# EAGLE design amebot_leds (EAGLE 6.5.0)
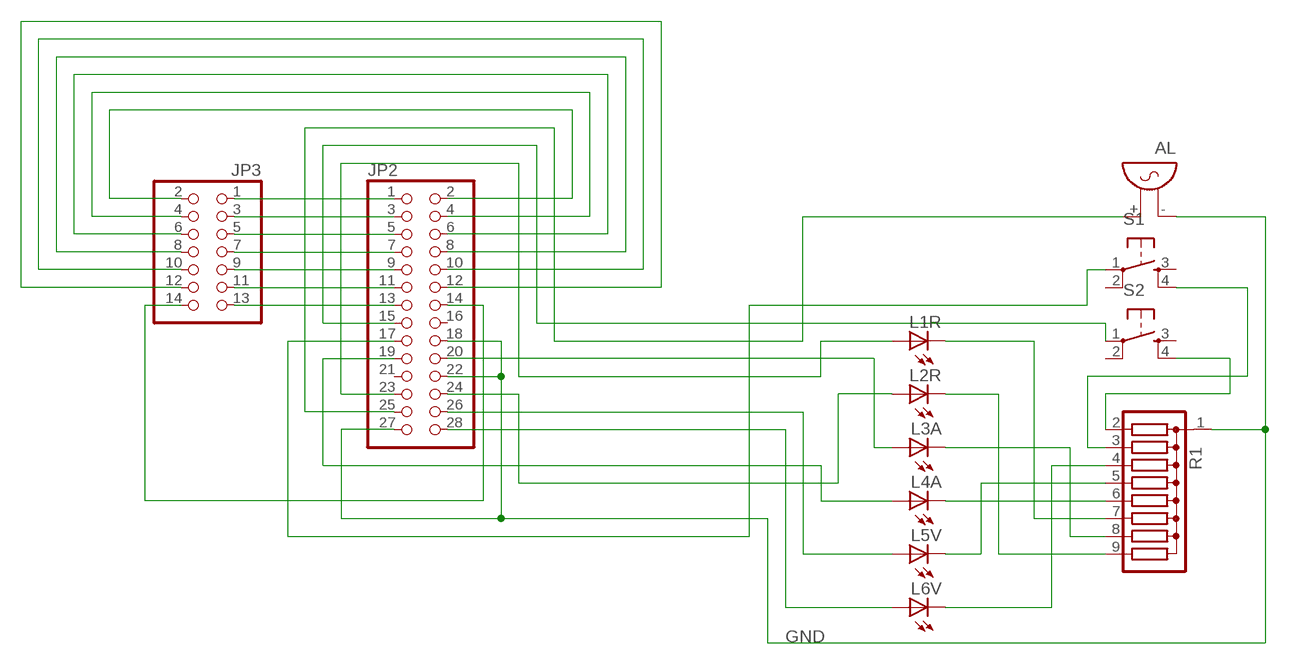
[diagram p0: schematic, sheet 1]

## Parts
AL  F/QMX  [F/QMX]
JP2  PINHD-2X14  [2X14]
JP3  PINHD-2X7  [2X07]
L1R  LED5MM  [LED5MM]
L2R  LED5MM  [LED5MM]
L3A  LED5MM  [LED5MM]
L4A  LED5MM  [LED5MM]
L5V  LED5MM  [LED5MM]
L6V  LED5MM  [LED5MM]
R1  G08R  [SIL9]
S1  DTS-6  [DTS-6]
S2  DTS-6  [DTS-6]

## Nets
GND: AL.- JP2.18 JP2.22 JP2.27
N$1: L5V.K(C) R1.5
N$2: JP2.23 L1R.A
N$3: AL.+ JP2.25
N$4: L3A.K(C) R1.8
N$5: JP2.15 S2.1
N$6: JP2.19 L4A.A
N$7: L4A.K(C) R1.6
N$8: L2R.K(C) R1.9
N$9: JP2.20 L3A.A
N$10: L1R.K(C) R1.7
N$12: L6V.K(C) R1.4
N$13: JP2.17 S1.1
N$15: R1.2 S2.4
N$16: R1.3 S1.4
N$21: JP2.24 L2R.A
N$23: JP2.28 L6V.A
N$24: JP2.26 L5V.A
N$28: JP2.1 JP3.1
N$29: JP2.3 JP3.3
N$30: JP2.5 JP3.5
N$31: JP2.7 JP3.7
N$32: JP2.9 JP3.9
N$33: JP2.11 JP3.11
N$34: JP2.13 JP3.13
N$35: JP2.2 JP3.2
N$36: JP2.4 JP3.4
N$37: JP2.6 JP3.6
N$38: JP2.8 JP3.8
N$39: JP2.10 JP3.10
N$40: JP2.12 JP3.12
N$41: JP2.14 JP3.14
Unconnected: JP2.16 JP2.21 R1.1 S1.2 S1.3 S2.2 S2.3

## Library data of the parts
AL = buzzer:F/QMX: BUZZER Source: Buerklin; OC_FARNELL: unknown; OC_NEWARK: unknown
JP2 = pinhead:PINHD-2X14: PIN HEADER
JP3 = pinhead:PINHD-2X7: PIN HEADER
L1R L2R L3A L4A L5V L6V = led:LED: LED OSRAM: - CHIPLED LG R971, LG N971, LY N971, LG Q971, LY Q971, LO R971, LY R971 LH N974, LH R974 LS Q976, LO Q976, LY Q976 LO Q996 - Hyper CHIPLED LW Q18S LB Q993, LB Q99A, LB R99A - SideLED LS A670, LO A670, LY A670, LG A670, LP A670 LB A673, LV A673, LT A673, LW A673 LH A674 LY A675 LS A676, LA A676, LO A676, LY A676, LW A676 LS A679, LY A679, LG A679 - Hyper Micro SIDELED® LS Y876, LA Y876, LO Y876, LY Y876 LT Y87S - SmartLED LW L88C, LW L88S LB L89C, LB L89S, LG L890 LS L89K, LO L89K, LY L89K LS L896, LA L896, LO L896, LY L896 - TOPLED LS T670, LO T670, LY T670, LG T670, LP T670 LSG T670, LSP T670, LSY T670, LOP T670, LYG T670 LG T671, LOG T671, LSG T671 LB T673, LV T673, LT T673, LW T673 LH T674 LS T676, LA T676, LO T676, LY T676, LB T676, LH T676, LSB T676, LW T676 LB T67C, LV T67C, LT T67C, LS T67K, LO T67K, LY T67K, LW E67C LS E67B, LA E67B, LO E67B, LY E67B, LB E67C, LV E67C, LT E67C LW T67C LS T679, LY T679, LG T679 LS T770, LO T770, LY T770, LG T770, LP T770 LB T773, LV T773, LT T773, LW T773 LH T774 LS E675, LA E675, LY E675, LS T675 LS T776, LA T776, LO T776, LY T776, LB T776 LHGB T686 LT T68C, LB T68C - Hyper Mini TOPLED® LB M676 - Mini TOPLED Santana® LG M470 LS M47K, LO M47K, LY M47K Source: http://www.osram.convergy.de LUXEON: - LUMILED® LXK2-PW12-R00, LXK2-PW12-S00, LXK2-PW14-U00, LXK2-PW14-V00 LXK2-PM12-R00, LXK2-PM12-S00, LXK2-PM14-U00 LXK2-PE12-Q00, LXK2-PE12-R00, LXK2-PE12-S00, LXK2-PE14-T00, LXK2-PE14-U00 LXK2-PB12-K00, LXK2-PB12-L00, LXK2-PB12-M00, LXK2-PB14-N00, LXK2-PB14-P00, LXK2-PB14-Q00 LXK2-PR12-L00, LXK2-PR12-M00, LXK2-PR14-Q00, LXK2-PR14-R00 LXK2-PD12-Q00, LXK2-PD12-R00, LXK2-PD12-S00 LXK2-PH12-R00, LXK2-PH12-S00 LXK2-PL12-P00, LXK2-PL12-Q00, LXK2-PL12-R00 Source: www.luxeon.com KINGBRIGHT: KA-3528ASYC Source: www.kingbright.com
R1 = resistor-sil:G08R: SIL RESISTOR; OC_FARNELL: unknown; OC_NEWARK: unknown
S1 S2 = switch-tact:DTS-6

## Board
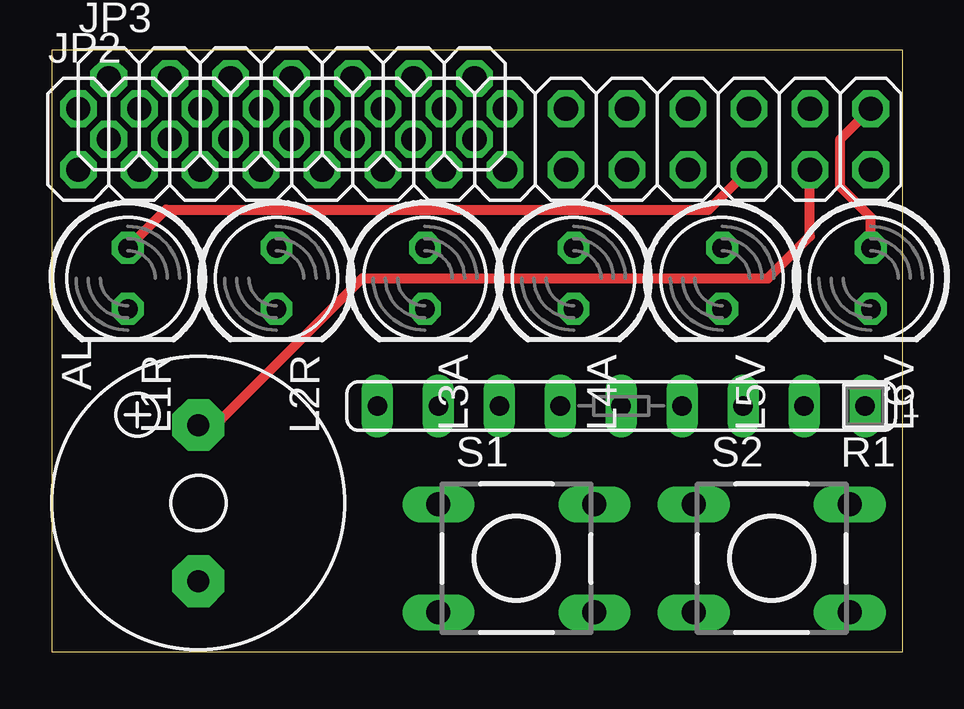
[diagram p1: board, top side]
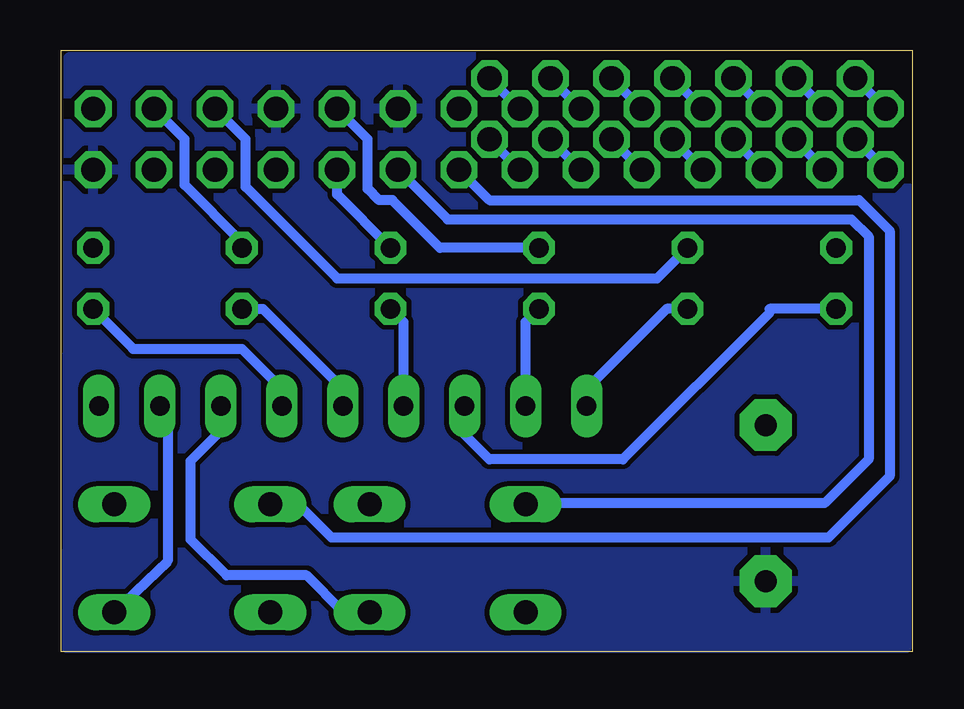
[diagram p2: board, bottom side, seen from below]

No outline drawn. Coordinates in mm, seen from the top.
Copper layers (1*16): Top 0.035mm / dielectric 1.5mm / Bottom 0.035mm
Design rules "default": minimum track width 10mil, minimum drill 24mil, track to track 8mil, track to pad 8mil, pad to pad 8mil, via to via 8mil, smd to smd 8mil, copper to edge 40mil, drill to drill 8mil, minimum pad ring 10mil, minimum via ring 8mil, stop-mask expansion 4mil, vias tented up to drill 0mil, thermal gap 10mil
Milling: 4 lines

### Footprints (pad centres in the part's own frame; a part is rotated, then mirrored left to right if it is on the bottom)
F/QMX = drill 0.914 pad 2.159 octagon: + 3.251,0; - -3.251,0
2X14 = drill 1.016 octagon: 1 -16.51,-1.27; 2 -16.51,1.27; 3 -13.97,-1.27; 4 -13.97,1.27; 5 -11.43,-1.27; 6 -11.43,1.27; 7 -8.89,-1.27; 8 -8.89,1.27; 9 -6.35,-1.27; 10 -6.35,1.27; 11 -3.81,-1.27; 12 -3.81,1.27; 13 -1.27,-1.27; 14 -1.27,1.27; 15 1.27,-1.27; 16 1.27,1.27; 17 3.81,-1.27; 18 3.81,1.27; 19 6.35,-1.27; 20 6.35,1.27; 21 8.89,-1.27; 22 8.89,1.27; 23 11.43,-1.27; 24 11.43,1.27; 25 13.97,-1.27; 26 13.97,1.27; 27 16.51,-1.27; 28 16.51,1.27
2X07 = drill 1.016 octagon: 1 -7.62,-1.27; 2 -7.62,1.27; 3 -5.08,-1.27; 4 -5.08,1.27; 5 -2.54,-1.27; 6 -2.54,1.27; 7 0,-1.27; 8 0,1.27; 9 2.54,-1.27; 10 2.54,1.27; 11 5.08,-1.27; 12 5.08,1.27; 13 7.62,-1.27; 14 7.62,1.27
LED5MM = drill 0.813 octagon: A -1.27,0; K 1.27,0
SIL9 = drill 0.813 long: 1 -10.16,0; 2 -7.62,0; 3 -5.08,0; 4 -2.54,0; 5 0,0; 6 2.54,0; 7 5.08,0; 8 7.62,0; 9 10.16,0
DTS-6 = drill 1 long: 1 -3.25,2.25; 2 3.25,2.25; 3 -3.25,-2.25; 4 3.25,-2.25

### Placement (x,y rotation side)
AL  6.11,6.19 90 top
JP2  17.62,21.35 0 top
JP3  10,22.62 0 top
L1R  3.17,15.56 270 top
L2R  9.37,15.56 270 top
L3A  15.56,15.56 270 top
L4A  21.75,15.56 270 top
L5V  27.94,15.56 270 top
L6V  34.13,15.56 270 top
R1  23.73,10.24 180 top
S1  19.37,3.89 0 top
S2  30,3.89 0 top

### Tracks (layer width: path | path; a pad name or v marks a point on that pad's centre or on a via)
GND
  pour Bottom: 0.24,24.77 35.16,24.77 35.24,0.16 0.24,0.16
N$1
  Bottom 0.406: L5V.K 27.07,14.29 23.81,11.03 23.81,10.32 R1.5
N$2
  Top 0.406: L1R.A 4.76,18.41 27.38,18.41 JP2.23
N$3
  Top 0.406: AL.+ 6.82,9.44 12.94,15.56 29.84,15.56 31.59,17.3 JP2.25
N$4
  Bottom 0.406: R1.8 16.11,13.73 L3A.K
N$5
  Bottom 0.406: JP2.15 17.62,18.81 2.22,18.81 0.95,17.54 0.95,7.3 3.29,4.96 3.49,4.76 24.21,4.76 25.59,6.14 S2.1
N$6
  Bottom 0.406: L4A.A 23.97,19.05 JP2.19
N$7
  Bottom 0.406: R1.6 21.19,13.73 L4A.K
N$8
  Bottom 0.406: L2R.K 10.24,14.29 13.57,10.95 R1.9
N$9
  Bottom 0.406: L3A.A 19.68,16.83 21.67,18.81 22.23,18.81 22.7,19.29 22.7,21.35 JP2.20
N$10
  Bottom 0.406: L1R.K 5.95,14.29 5.95,14.13 12.06,8.02 17.62,8.02 18.65,9.05 R1.7
N$12
  Bottom 0.406: L6V.K 32.46,12.62 27.94,12.62 26.27,10.95 R1.4
N$13
  Bottom 0.406: JP2.17 19.37,18.02 2.54,18.02 1.83,17.3 1.83,8.02 3.65,6.19 16.07,6.19 S1.1
N$15
  Bottom 0.406: S2.4 31.04,3.78 31.04,9.92 R1.2
N$16
  Bottom 0.406: R1.3 28.81,9.21 30.08,7.94 30.08,4.68 28.57,3.17 25.24,3.17 23.71,1.64 S1.4
N$21
  Bottom 0.406: JP2.24 27.78,21.35 27.78,19.37 23.97,15.56 10.64,15.56 L2R.A
N$23
  Top 0.406: JP2.28 32.86,21.35 32.86,19.37 34.13,18.1 L6V.A
N$24
  Bottom 0.406: JP2.26 30.32,21.35 30.32,19.45 27.94,17.07 L5V.A
N$28
  Bottom 0.406: JP3.1 JP2.1
N$29
  Bottom 0.406: JP3.3 JP2.3
N$30
  Bottom 0.406: JP3.5 JP2.5
N$31
  Bottom 0.406: JP3.7 JP2.7
N$32
  Bottom 0.406: JP3.9 JP2.9
N$33
  Bottom 0.406: JP3.11 JP2.11
N$34
  Bottom 0.406: JP3.13 JP2.13
N$35
  Bottom 0.406: JP3.2 JP2.2
N$36
  Bottom 0.406: JP3.4 JP2.4
N$37
  Bottom 0.406: JP3.6 JP2.6
N$38
  Bottom 0.406: JP3.8 JP2.8
N$39
  Bottom 0.406: JP3.10 JP2.10
N$40
  Bottom 0.406: JP3.12 JP2.12
N$41
  Bottom 0.406: JP3.14 JP2.14